# Altium schematic sheet PCB_Schematic.SchDoc
size A4; SheetNumber: 1; SheetTotal: 1
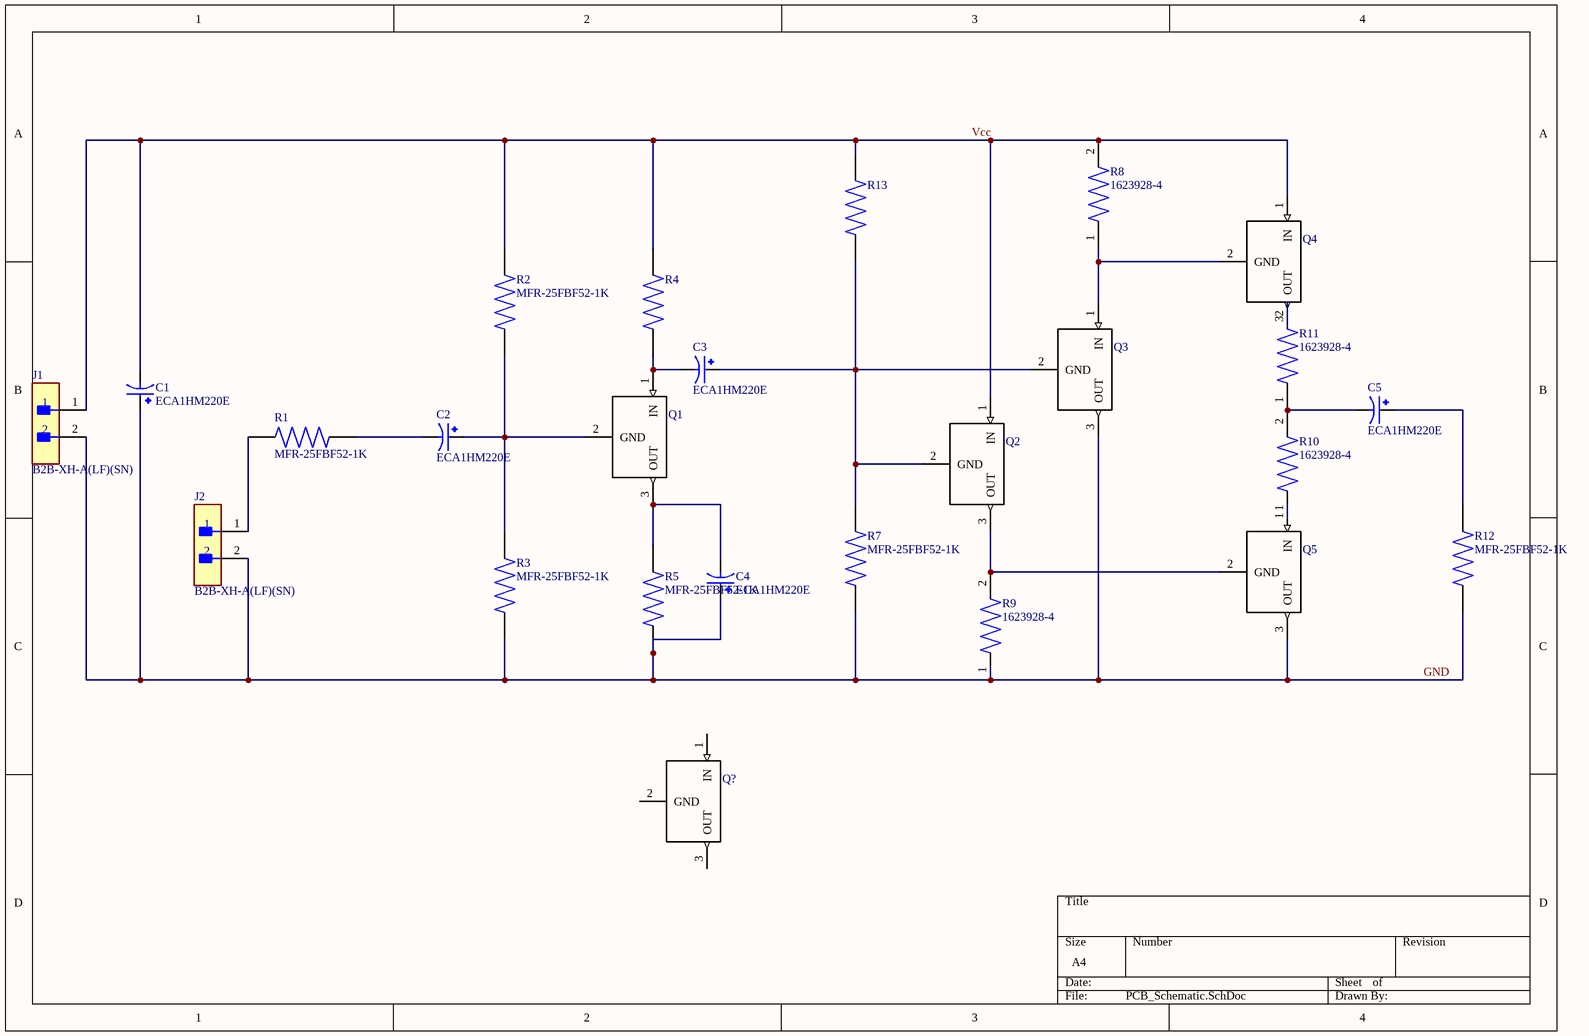
[diagram p0: PCB_Schematic.SchDoc]

## Parts
C1  ECA1HM220E  [CAPPRD500W50D500H1100]
C2  ECA1HM220E  [CAPPRD500W50D500H1100]
C3  ECA1HM220E  [CAPPRD500W50D500H1100]
C4  ECA1HM220E  [CAPPRD500W50D500H1100]
C5  ECA1HM220E  [CAPPRD500W50D500H1100]
J1  B2B-XH-A(LF)(SN)  [FP-B2B-XH-A_LF_SN-MFG]
J2  B2B-XH-A(LF)(SN)  [FP-B2B-XH-A_LF_SN-MFG]
Q1  LM7805CT/NOPB  [TO254P1054X470X2600-3]  (value not drawn)
Q2  LM7805CT/NOPB  [TO254P1054X470X2600-3]  (value not drawn)
Q3  LM7805CT/NOPB  [TO254P1054X470X2600-3]  (value not drawn)
Q4  LM7805CT/NOPB  [TO254P1054X470X2600-3]  (value not drawn)
Q5  LM7805CT/NOPB  [TO254P1054X470X2600-3]  (value not drawn)
Q?  LM7805CT/NOPB  [TO254P1054X470X2600-3]  (value not drawn)
R1  MFR-25FBF52-1K  [RESAD1100W55L680D260]
R2  MFR-25FBF52-1K  [RESAD1100W55L680D260]
R3  MFR-25FBF52-1K  [RESAD1100W55L680D260]
R4  MFR-25FBF52-1K  [RESAD1100W55L680D260]  (value not drawn)
R5  MFR-25FBF52-1K  [RESAD1100W55L680D260]
R7  MFR-25FBF52-1K  [RESAD1100W55L680D260]
R8  1623928-4  [RESAD700W45L350D185]
R9  1623928-4  [RESAD700W45L350D185]
R10  1623928-4  [RESAD700W45L350D185]
R11  1623928-4  [RESAD700W45L350D185]
R12  MFR-25FBF52-1K  [RESAD1100W55L680D260]
R13  MFR-25FBF52-1K  [RESAD1100W55L680D260]  (value not drawn)

## Nets
GND: C1.P C4.P J1.2 J2.2 Q3.3(OUT) Q5.3(OUT) R3.1 R5.1 R7.1 R9.1 R12.1
Vcc: C1.N J1.1 Q2.1(IN) Q4.1(IN) R2.2 R4.2 R8.2 R13.2
NetC2_N: C2.N R1.2
NetC2_P: C2.P Q1.2(GND) R2.1 R3.2
NetC3_N: C3.N Q1.1(IN) R4.1
NetC3_P: C3.P Q2.2(GND) Q3.2(GND) R7.2 R13.1
NetC4_N: C4.N Q1.3(OUT) R5.2
NetC5_N: C5.N R10.2 R11.1
NetC5_P: C5.P R12.2
NetJ2_1: J2.1 R1.1
NetQ2_3: Q2.3(OUT) Q5.2(GND) R9.2
NetQ3_1: Q3.1(IN) Q4.2(GND) R8.1
NetQ4_3: Q4.3(OUT) R11.2
NetQ5_1: Q5.1(IN) R10.1

Not connected (* = marked no-connect by the designer): Q? 1(IN) 2(GND) 3(OUT)

## Library data of the parts
C1-C5 = ECA1HM220E: Aluminum Electrolytic Capacitors - Radial Leaded; MF: Panasonic; MP: ECA-1HM220E; Price: None; SnapEDA_Link: https://www.snapeda.com/parts/ECA-1HM220E/Panasonic/view-part/6222795/?ref=snap; Value: *; Package: RADIAL-2 Panasonic; Check_prices: https://www.snapeda.com/parts/ECA-1HM220E/Panasonic/view-part/6222795/?ref=eda; Availability: In Stock
J1 J2 = CMP-2000-05888-3: CONN HEADER VERT 2POS 2.5MM; Current Rating: 3A; Voltage Rating: 250V; Number of Contacts: 2; Contact Resistance: 20mR; Wire/Cable Gauge: 22AWG; Insulation Resistance: 1GR; Connector Type: Male Pin; Packaging: Bulk; Contact Material: Brass; Lead Free: Lead Free; Orientation: Straight; Contact Plating: Tin; Max Current Rating: 3A; Termination: Solder; Fastening Type: Detent; Depth: 5.75mm; Housing Material: Polyamide; REACH SVHC: No SVHC; Series: XH; Voltage Rating (AC): 250V; Number of Positions: 2; Color: Natural; Contact Type: Male Pin; Max Voltage Rating (DC): 250V; Pitch: 2.5mm; Lead Pitch: 2.5mm; Mount: Through Hole; Max Operating Temperature: 85°C; Length: 7.4mm; Max Voltage Rating (AC): 250V; Min Operating Temperature: -25°C; Number of Rows: 1; Housing Color: White
Q1-Q5 Q? = LM7805CT/NOPB: IC Regulator 7805T/LM7805T COMSET RoHS TO220; MF: Comset Semiconductors; Price: None; Availability: Not in stock; MP: LM7805CT; Package: TO-220 Comset Semiconductors; SnapEDA_Link: https://www.snapeda.com/parts/LM7805CT/Comset+Semiconductors/view-part/?ref=snap; Check_prices: https://www.snapeda.com/parts/LM7805CT/Comset+Semiconductors/view-part/?ref=eda; Value: *
R1-R5 R7 R12 R13 = MFR-25FBF52-1K: 1.07 kOhms Â±1% 0.25W, 1/4W Through Hole Resistor Axial - Metal Film; MF: Yageo; Value: *; SnapEDA_Link: https://www.snapeda.com/parts/MFR-25FBF52-1K/Yageo/view-part/?ref=snap; Purchase-URL: https://pricing.snapeda.com/search/part/MFR-25FBF52-1K/?ref=eda; Availability: In Stock; Price: None; Package: Axial Yageo; Check_prices: https://www.snapeda.com/parts/MFR-25FBF52-1K/Yageo/view-part/?ref=eda; MP: MFR-25FBF52-1K
R8-R11 = 1623928-4: CFR16 5% 10K; Package: None; Price: None; Value: *; MP: 1623928-4; Availability: Unavailable